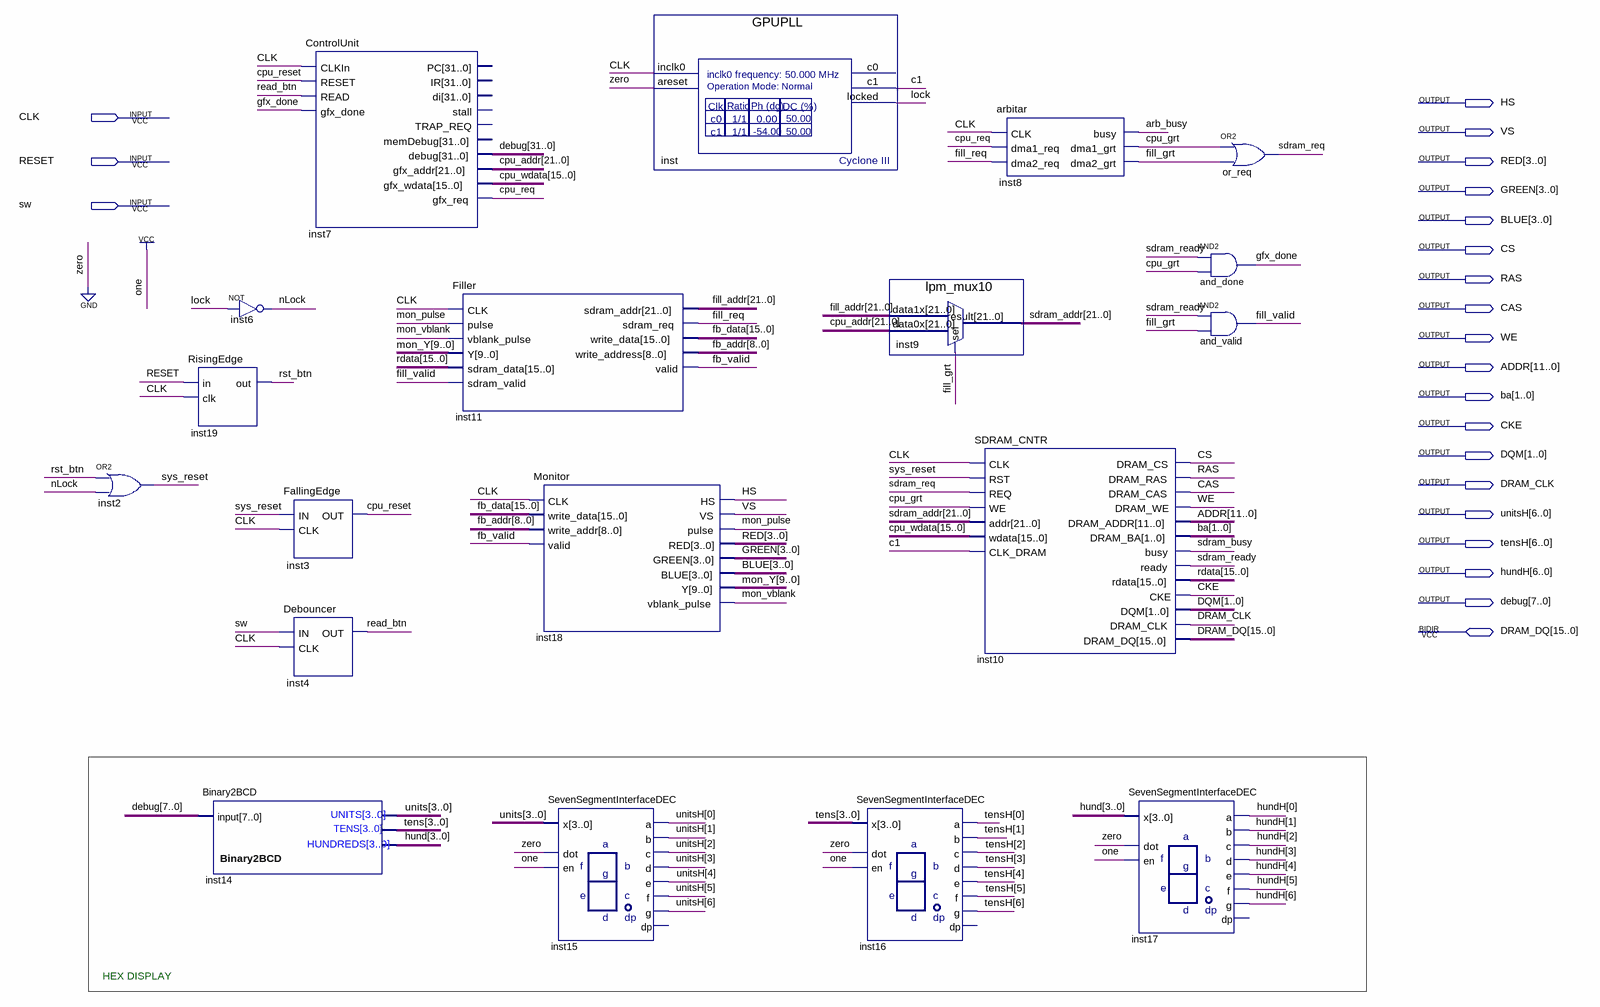
[diagram p0: schematic sheet]
// Quartus schematic UMamiSystem.bdf as structural Verilog: 19 symbols, 22 pins
module UMamiSystem (
  input  CLK,
  input  RESET,
  input  sw,
  inout  [15:0] DRAM_DQ,
  output HS,
  output VS,
  output [3:0] RED,
  output [3:0] GREEN,
  output [3:0] BLUE,
  output CS,
  output RAS,
  output CAS,
  output WE,
  output [11:0] ADDR,
  output [1:0] ba,
  output CKE,
  output [1:0] DQM,
  output DRAM_CLK,
  output [6:0] unitsH,
  output [6:0] tensH,
  output [6:0] hundH,
  output [31:0] debug
);

  wire arb_busy, c1, cpu_grt, cpu_req, cpu_reset, fb_valid, fill_grt, fill_req, fill_valid, gfx_done, lock,
       mon_pulse, mon_vblank, nLock, read_btn, rst_btn, sdram_busy, sdram_ready, sdram_req, sys_reset;
  wire [3:0] hund, tens, units;
  wire [8:0] fb_addr;
  wire [9:0] mon_Y;
  wire [15:0] cpu_wdata, fb_data, rdata;
  wire [21:0] cpu_addr, fill_addr, sdram_addr;

  or inst2 (sys_reset, rst_btn, nLock);
  RisingEdge inst19 (.in(RESET), .clk(CLK), .out(rst_btn));
  not inst6 (nLock, lock);
  Binary2BCD inst14 (.\input (debug[7:0]), .bcd_hundreds(hund), .bcd_tens(tens), .bcd_units(units));
  ControlUnit inst7 (
    .CLKIn(CLK), .RESET(cpu_reset), .READ(read_btn), .gfx_done(gfx_done), .debug(debug), .gfx_addr(cpu_addr),
    .gfx_wdata(cpu_wdata), .gfx_req(cpu_req));  // open: PC, IR, di, stall, TRAP_REQ, memDebug
  FallingEdge inst3 (.IN(sys_reset), .CLK(CLK), .OUT(cpu_reset));
  Debouncer inst4 (.IN(sw), .CLK(CLK), .OUT(read_btn));
  Filler inst11 (
    .CLK(CLK), .pulse(mon_pulse), .vblank_pulse(mon_vblank), .Y(mon_Y), .sdram_data(rdata),
    .sdram_valid(fill_valid), .sdram_addr(fill_addr), .sdram_req(fill_req), .write_data(fb_data),
    .write_address(fb_addr), .valid(fb_valid));
  Monitor inst18 (
    .CLK(CLK), .write_data(fb_data), .write_addr(fb_addr), .valid(fb_valid), .HS(HS), .VS(VS),
    .pulse(mon_pulse), .RED(RED), .GREEN(GREEN), .BLUE(BLUE), .Y(mon_Y), .vblank_pulse(mon_vblank));
  SevenSegmentInterfaceDEC inst15 (
    .dot(1'b0), .en(1'b1), .x(units), .a(unitsH[0]), .b(unitsH[1]), .c(unitsH[2]), .d(unitsH[3]),
    .e(unitsH[4]), .f(unitsH[5]), .g(unitsH[6]));  // open: dp
  GPUPLL inst (.inclk0(CLK), .areset(1'b0), .c1(c1), .locked(lock));  // open: c0
  lpm_mux10 inst9 (.data1x(fill_addr), .data0x(cpu_addr), .sel(fill_grt), .result(sdram_addr));
  SevenSegmentInterfaceDEC inst16 (
    .dot(1'b0), .en(1'b1), .x(tens), .a(tensH[0]), .b(tensH[1]), .c(tensH[2]), .d(tensH[3]), .e(tensH[4]),
    .f(tensH[5]), .g(tensH[6]));  // open: dp
  arbitar inst8 (
    .CLK(CLK), .dma1_req(cpu_req), .dma2_req(fill_req), .busy(arb_busy), .dma1_grt(cpu_grt),
    .dma2_grt(fill_grt));
  SDRAM_CNTR inst10 (
    .CLK(CLK), .RST(sys_reset), .REQ(sdram_req), .WE(cpu_grt), .addr(sdram_addr), .wdata(cpu_wdata),
    .CLK_DRAM(c1), .DRAM_CS(CS), .DRAM_RAS(RAS), .DRAM_CAS(CAS), .DRAM_WE(WE), .DRAM_ADDR(ADDR),
    .DRAM_BA(ba), .busy(sdram_busy), .ready(sdram_ready), .rdata(rdata), .CKE(CKE), .DQM(DQM),
    .DRAM_CLK(DRAM_CLK), .DRAM_DQ(DRAM_DQ));
  SevenSegmentInterfaceDEC inst17 (
    .dot(1'b0), .en(1'b1), .x(hund), .a(hundH[0]), .b(hundH[1]), .c(hundH[2]), .d(hundH[3]), .e(hundH[4]),
    .f(hundH[5]), .g(hundH[6]));  // open: dp
  or or_req (sdram_req, cpu_grt, fill_grt);
  and and_done (gfx_done, sdram_ready, cpu_grt);
  and and_valid (fill_valid, sdram_ready, fill_grt);

  // Notes on the sheet:
  //   HEX DISPLAY
endmodule
